# EAGLE design 3400 (EAGLE 9.6.2)
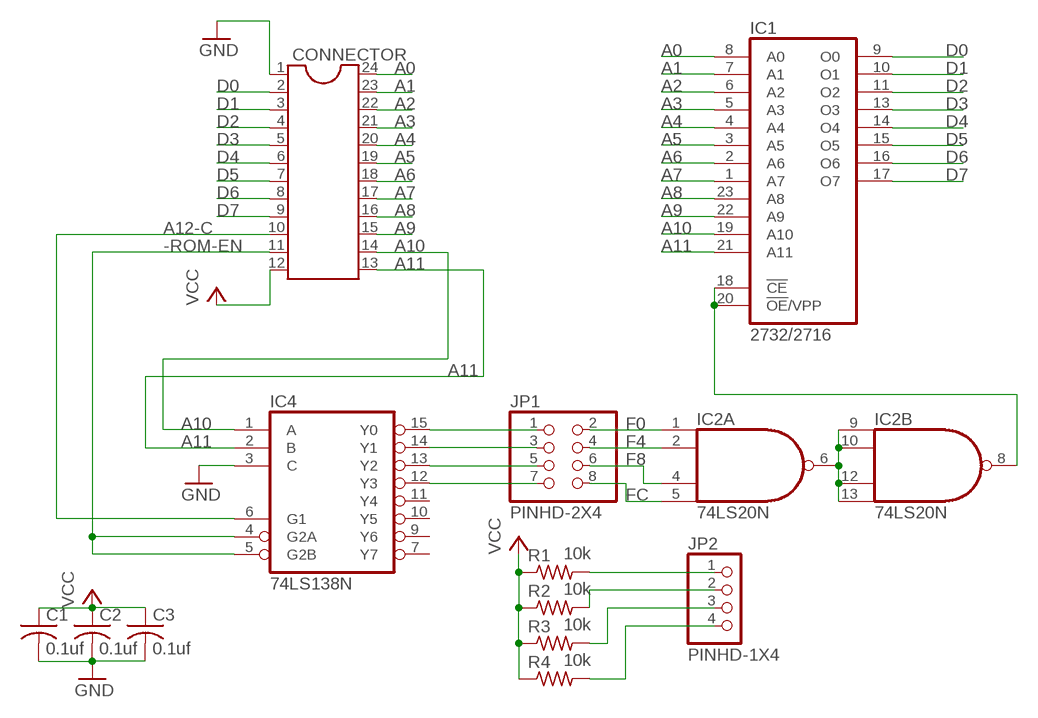
[diagram p0: schematic, sheet 1]

## Parts
C1  0.1uf  C-US025-024X044  [C025-024X044]
C2  0.1uf  C-US025-024X044  [C025-024X044]
C3  0.1uf  C-US025-024X044  [C025-024X044]
CONNECTOR  DIL24-6  [DIL24-6]
IC1  2732/2716  2732  [DIL24]
IC2  74LS20N  [DIL14]
IC4  74LS138N  [DIL16]
JP1  PINHD-2X4  [2X04]
JP2  PINHD-1X4  [1X04]
R1  10k  R-US_0207/10  [0207/10]
R2  10k  R-US_0207/10  [0207/10]
R3  10k  R-US_0207/10  [0207/10]
R4  10k  R-US_0207/10  [0207/10]

## Nets
-ROM-EN: CONNECTOR.11 IC4.4(G2A) IC4.5(G2B)
A0: CONNECTOR.24 IC1.8(A0)
A1: CONNECTOR.23 IC1.7(A1)
A2: CONNECTOR.22 IC1.6(A2)
A3: CONNECTOR.21 IC1.5(A3)
A4: CONNECTOR.20 IC1.4(A4)
A5: CONNECTOR.19 IC1.3(A5)
A6: CONNECTOR.18 IC1.2(A6)
A7: CONNECTOR.17 IC1.1(A7)
A8: CONNECTOR.16 IC1.23(A8)
A9: CONNECTOR.15 IC1.22(A9)
A10: CONNECTOR.14 IC1.19(A10) IC4.1(A)
A11: CONNECTOR.13 IC1.21(A11) IC4.2(B)
A12-C: CONNECTOR.10 IC4.6(G1)
D0: CONNECTOR.2 IC1.9(O0)
D1: CONNECTOR.3 IC1.10(O1)
D2: CONNECTOR.4 IC1.11(O2)
D3: CONNECTOR.5 IC1.13(O3)
D4: CONNECTOR.6 IC1.14(O4)
D5: CONNECTOR.7 IC1.15(O5)
D6: CONNECTOR.8 IC1.16(O6)
D7: CONNECTOR.9 IC1.17(O7)
F0: IC2.1(A:I0) JP1.2
F4: IC2.2(A:I1) JP1.4
F8: IC2.4(A:I2) JP1.6
FC: IC2.5(A:I3) JP1.8
GND: C1.2 C2.2 C3.2 CONNECTOR.1 IC4.3(C)
N$1: IC1.18(!CE) IC1.20(!OE!/VPP) IC2.8(B:O)
N$2: IC4.15(Y0) JP1.1
N$3: IC2.6(A:O) IC2.9(B:I0) IC2.10(B:I1) IC2.12(B:I2) IC2.13(B:I3)
N$4: IC4.14(Y1) JP1.3
N$5: IC4.13(Y2) JP1.5
N$6: IC4.12(Y3) JP1.7
N$11: JP2.1 R1.2
N$12: JP2.2 R2.2
N$13: JP2.3 R3.2
N$14: JP2.4 R4.2
VCC: C1.1 C2.1 C3.1 CONNECTOR.12 R1.1 R2.1 R3.1 R4.1
Unconnected: IC4.7(Y7) IC4.9(Y6) IC4.10(Y5) IC4.11(Y4)

## Power pins joined to a net without a drawn wire
GND: IC1.12(GND) IC2.7(P:GND) IC4.8(GND)
VCC: IC1.24(VCC) IC2.14(P:VCC) IC4.16(VCC)

## Library data of the parts
C1-C3 = rcl:C-US: CAPACITOR, American symbol; SPICEPREFIX: C
CONNECTOR = ic-package:DIL24: Dual In Line
IC1 = memory:2732: MEMORY
IC2 = 74xx-us:74*20: Dual 4-input NAND gate
IC4 = 74xx-us:74*138: 3-line to 8-line DECODER/DEMULTIPLEXER
JP1 = Connector:PINHD-2X4: PIN HEADER; CATEGORY: CONNECTOR; SUB-CATEGORY: PIN-HEADER
JP2 = Connector:PINHD-1X4: PIN HEADER; CATEGORY: CONNECTOR; SUB-CATEGORY: PIN-HEADER
R1-R4 = rcl:R-US_: RESISTOR, American symbol; SPICEPREFIX: R

## Board
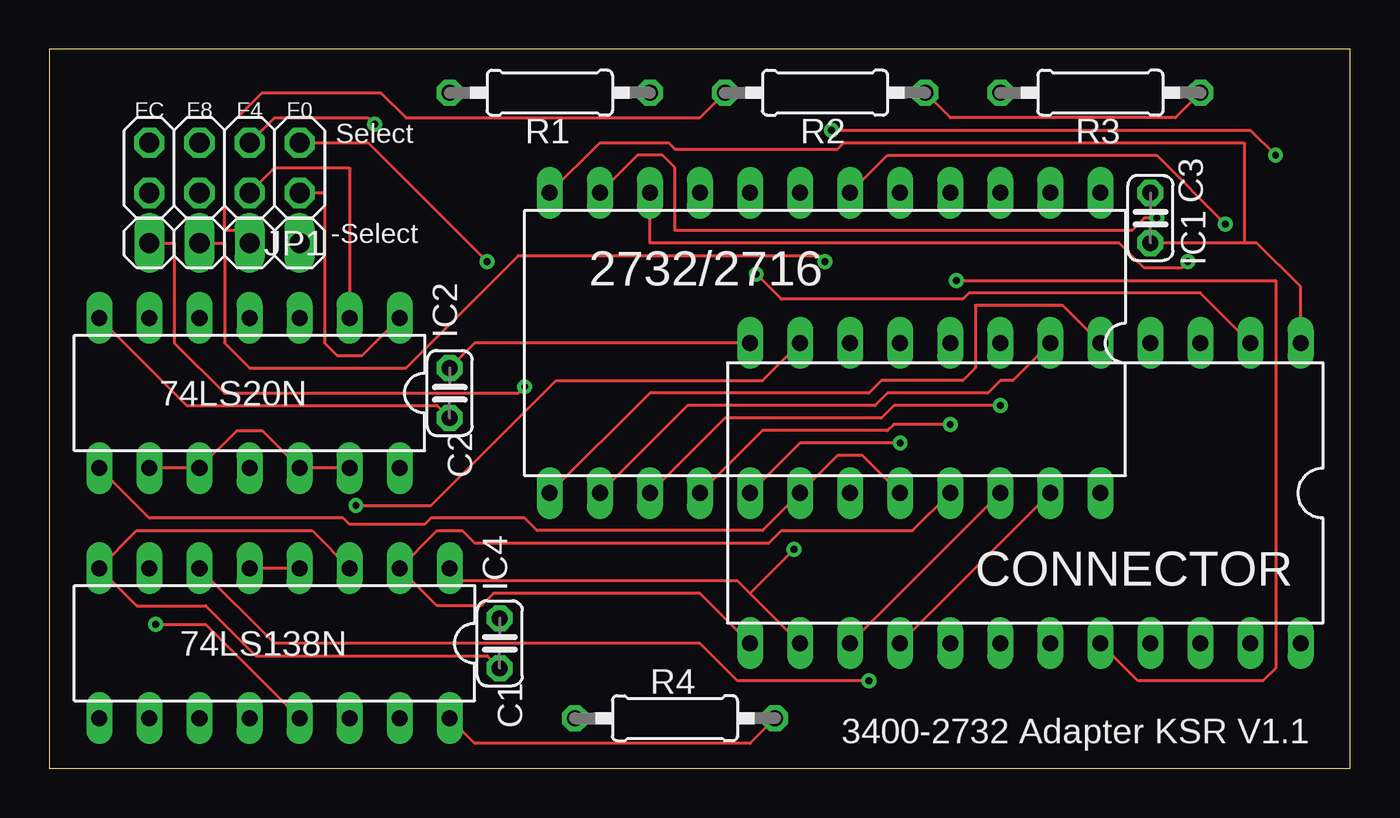
[diagram p1: board, top side]
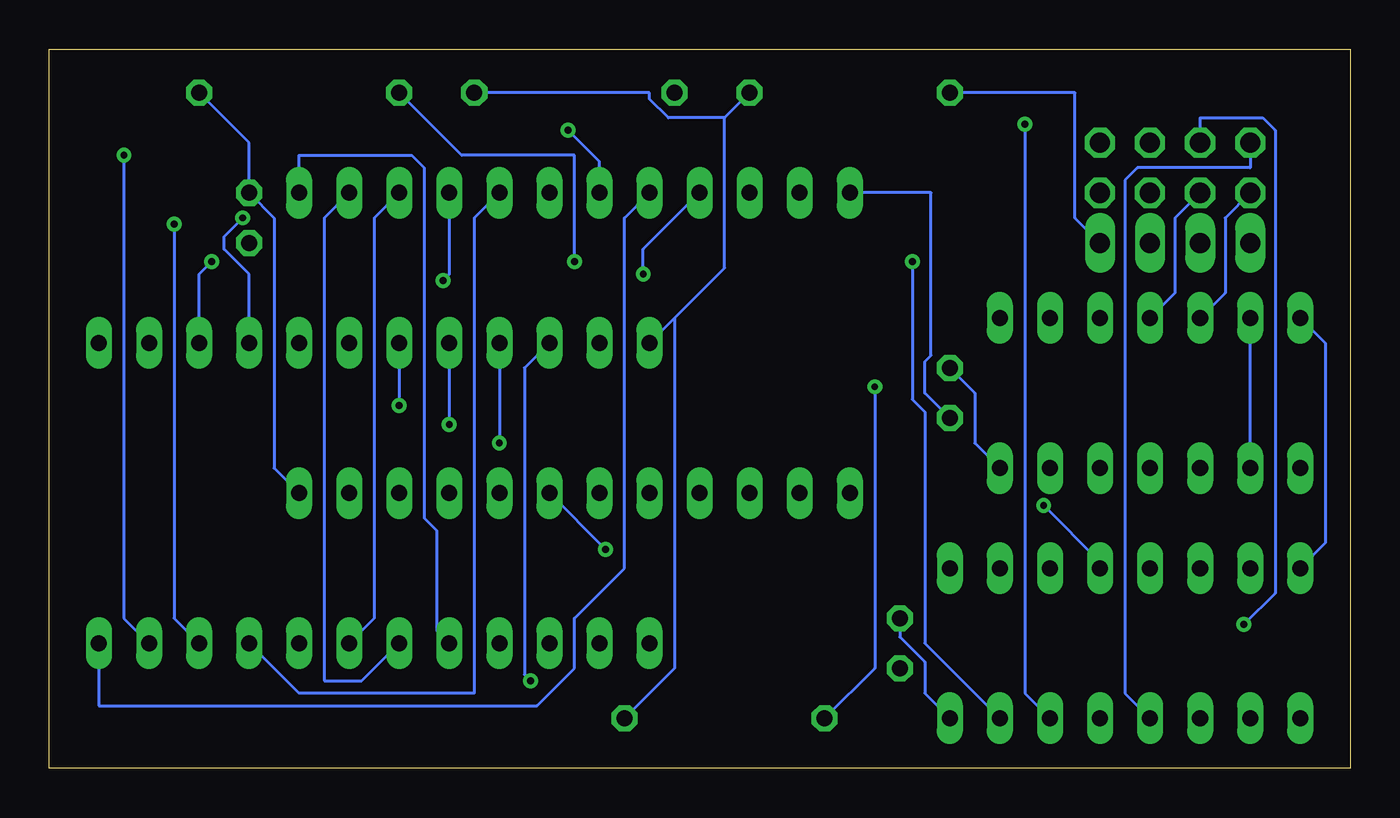
[diagram p2: board, bottom side, seen from below]

Size 66.02 x 36.5 mm. Coordinates in mm from the lower left corner, seen from the top.
Outline: 0,0 66.02,0 66.02,36.5 0,36.5 0,0
Copper layers (1*16): Top 0.035mm / dielectric 0.15mm / Bottom 0.035mm
Design rules "default *": minimum track width 6mil, minimum drill 0.35mm, track to track 15mil, track to pad 15mil, pad to pad 6mil, via to via 6mil, smd to smd 6mil, copper to edge 40mil, drill to drill 6mil, minimum pad ring 10mil, minimum via ring 8mil, stop-mask expansion 4mil, vias tented up to drill 0mil, thermal gap 10mil

### Footprints (pad centres in the part's own frame; a part is rotated, then mirrored left to right if it is on the bottom)
C025-024X044 = drill 0.813 octagon: 1 -1.27,0; 2 1.27,0
DIL24-6 = drill 0.813 long: 1 -13.97,-7.62; 2 -11.43,-7.62; 3 -8.89,-7.62; 4 -6.35,-7.62; 5 -3.81,-7.62; 6 -1.27,-7.62; 7 1.27,-7.62; 8 3.81,-7.62; 9 6.35,-7.62; 10 8.89,-7.62; 11 11.43,-7.62; 12 13.97,-7.62; 13 13.97,7.62; 14 11.43,7.62; 15 8.89,7.62; 16 6.35,7.62; 17 3.81,7.62; 18 1.27,7.62; 19 -1.27,7.62; 20 -3.81,7.62; 21 -6.35,7.62; 22 -8.89,7.62; 23 -11.43,7.62; 24 -13.97,7.62
DIL24 = drill 0.813 long: 1 -13.97,-7.62; 2 -11.43,-7.62; 3 -8.89,-7.62; 4 -6.35,-7.62; 5 -3.81,-7.62; 6 -1.27,-7.62; 7 1.27,-7.62; 8 3.81,-7.62; 9 6.35,-7.62; 10 8.89,-7.62; 11 11.43,-7.62; 12 13.97,-7.62; 13 13.97,7.62; 14 11.43,7.62; 15 8.89,7.62; 16 6.35,7.62; 17 3.81,7.62; 18 1.27,7.62; 19 -1.27,7.62; 20 -3.81,7.62; 21 -6.35,7.62; 22 -8.89,7.62; 23 -11.43,7.62; 24 -13.97,7.62
DIL14 = drill 0.813 long: 1 -7.62,-3.81; 2 -5.08,-3.81; 3 -2.54,-3.81; 4 0,-3.81; 5 2.54,-3.81; 6 5.08,-3.81; 7 7.62,-3.81; 8 7.62,3.81; 9 5.08,3.81; 10 2.54,3.81; 11 0,3.81; 12 -2.54,3.81; 13 -5.08,3.81; 14 -7.62,3.81
DIL16 = drill 0.813 long: 1 -8.89,-3.81; 2 -6.35,-3.81; 3 -3.81,-3.81; 4 -1.27,-3.81; 5 1.27,-3.81; 6 3.81,-3.81; 7 6.35,-3.81; 8 8.89,-3.81; 9 8.89,3.81; 10 6.35,3.81; 11 3.81,3.81; 12 1.27,3.81; 13 -1.27,3.81; 14 -3.81,3.81; 15 -6.35,3.81; 16 -8.89,3.81
2X04 = drill 1.016 octagon: 1 -3.81,-1.27; 2 -3.81,1.27; 3 -1.27,-1.27; 4 -1.27,1.27; 5 1.27,-1.27; 6 1.27,1.27; 7 3.81,-1.27; 8 3.81,1.27
1X04 = drill 1.016 long: 1 -3.81,0; 2 -1.27,0; 3 1.27,0; 4 3.81,0
0207/10 = drill 0.813 octagon: 1 -5.08,0; 2 5.08,0

### Placement (x,y rotation side)
C1  22.86,6.35 270 top
C2  20.32,19.05 270 top
C3  55.88,27.94 270 top
CONNECTOR  49.53,13.97 180 top
IC1  39.37,21.59 180 top
IC2  10.16,19.05 180 top
IC4  11.43,6.35 180 top
JP1  8.89,30.48 180 top
JP2  8.89,26.67 180 top
R1  25.4,34.29 180 top
R2  39.37,34.29 180 top
R3  53.34,34.29 180 top
R4  31.75,2.54 180 top

### Tracks (layer width: path | path; a pad name or v marks a point on that pad's centre or on a via)
-ROM-EN  (via drill 0.35)
  Top 0.152: IC4.4 IC4.5 | CONNECTOR.11 36.2,19.68 25.72,19.68 19.37,13.34 v15.56,13.34
  Bottom 0.152: v15.56,13.34 12.7,10.48 IC4.4
A0
  Bottom 0.152: IC1.8 36.83,27.94 36.83,10.16 39.37,7.62 39.37,5.08 41.27,3.17 63.5,3.17 CONNECTOR.24
A1  (via drill 0.35)
  Top 0.152: v62.23,31.11 60.96,32.38 v39.69,32.38
  Bottom 0.152: CONNECTOR.23 62.23,7.62 v62.23,31.11 | v39.69,32.38 38.1,30.8 IC1.7
A2  (via drill 0.35)
  Top 0.152: v59.69,27.62 56.2,31.11 42.55,31.11 IC1.6
  Bottom 0.152: CONNECTOR.22 59.69,7.62 v59.69,27.62
A3
  Bottom 0.152: CONNECTOR.21 53.34,3.81 44.45,3.81 44.45,27.94 IC1.5
A4  (via drill 0.35)
  Top 0.152: CONNECTOR.20 55.24,4.45 61.59,4.45 62.23,5.08 62.23,24.77 v46.04,24.77
  Bottom 0.152: v46.04,24.77 45.72,25.08 IC1.4
A5
  Bottom 0.152: CONNECTOR.19 49.53,7.62 49.53,27.94 IC1.3
A6
  Bottom 0.152: CONNECTOR.18 50.16,4.45 52.07,4.45 52.07,27.94 IC1.2
A7
  Bottom 0.152: CONNECTOR.17 46.35,6.99 46.35,12.06 46.99,12.7 46.99,30.48 47.62,31.11 53.34,31.11 IC1.1
A8
  Top 0.152: IC1.23 CONNECTOR.16
A9
  Top 0.152: IC1.22 CONNECTOR.15
A10  (via drill 0.35)
  Top 0.152: IC4.1 20.95,9.53 34.92,9.53 35.56,8.89 | CONNECTOR.14 35.56,8.89 | 35.56,8.89 v37.78,11.11
  Bottom 0.152: v37.78,11.11 IC1.19
A11
  Top 0.152: CONNECTOR.13 33.02,8.89 22.54,8.89 21.91,8.26 19.68,8.26 IC4.2 19.68,12.06 20.95,12.06 21.59,11.43 36.51,11.43 37.15,12.06 43.81,12.06 IC1.21
A12-C  (via drill 0.35)
  Top 0.152: IC4.6 11.43,6.35 33.02,6.35 34.92,4.45 v41.59,4.45
  Bottom 0.152: v41.59,4.45 41.91,4.76 41.91,20.32 CONNECTOR.10
D0  (via drill 0.35)
  Top 0.152: v35.88,25.08 37.15,23.81 46.35,23.81 46.67,24.13 58.42,24.13 CONNECTOR.2
  Bottom 0.152: IC1.9 35.88,26.35 v35.88,25.08
D1  (via drill 0.35)
  Top 0.152: IC1.10 30.48,26.67 54.29,26.67 55.56,25.4 57.47,25.4 v57.78,25.72
  Bottom 0.152: v57.78,25.72 58.42,25.08 CONNECTOR.3
D2  (via drill 0.35)
  Top 0.152: IC1.11 29.84,31.11 31.11,31.11 31.75,30.48 31.75,27.3 54.93,27.3 55.56,27.94 v56.2,27.94
  Bottom 0.152: v56.2,27.94 57.15,26.99 57.15,26.35 55.88,25.08 CONNECTOR.4
D3
  Top 0.152: IC1.13 30.48,19.05 41.59,19.05 42.23,19.68 46.35,19.68 46.99,20.32 46.99,23.5 51.44,23.5 CONNECTOR.5
D4
  Top 0.152: IC1.14 32.38,18.41 41.91,18.41 42.55,19.05 47.62,19.05 48.26,19.68 48.9,19.68 CONNECTOR.6
D5  (via drill 0.35)
  Top 0.152: IC1.15 34.29,17.78 42.23,17.78 42.86,18.41 v48.26,18.41
  Bottom 0.152: CONNECTOR.7 v48.26,18.41
D6  (via drill 0.35)
  Top 0.152: IC1.16 36.2,17.14 42.55,17.14 42.86,17.46 v45.72,17.46
  Bottom 0.152: CONNECTOR.8 v45.72,17.46
D7  (via drill 0.35)
  Top 0.152: IC1.17 38.1,16.51 v43.18,16.51
  Bottom 0.152: CONNECTOR.9 v43.18,16.51
F0
  Top 0.152: IC2.1 15.88,20.95 14.61,20.95 13.97,21.59 13.97,29.21 JP1.2
F4
  Top 0.152: IC2.2 15.24,30.48 11.43,30.48 JP1.4
F8
  Bottom 0.152: IC2.4 8.89,24.13 8.89,27.94 JP1.6
FC
  Bottom 0.152: IC2.5 6.35,24.13 6.35,27.94 JP1.8
GND
  Top 0.152: 60.64,26.67 61.28,26.67 63.5,24.45 CONNECTOR.1 | 60.64,26.67 C3.2 | IC4.3 13.34,12.06 4.45,12.06 IC4.8 4.45,8.26 7.94,8.26 10.48,5.71 22.23,5.71 C1.2 | C2.2 19.68,18.41 6.99,18.41 IC2.7 | 60.64,26.67 60.64,31.75 40.32,31.75 40.01,31.43 31.75,31.43 31.43,31.75 27.94,31.75 IC1.12
  Bottom 0.152: IC4.8 1.27,11.43 1.27,21.59 IC2.7 | IC1.12 21.27,29.21 21.27,20.95 21.59,20.64 21.59,19.05 C2.2
N$1
  Top 0.152: IC1.20 41.27,15.88 40.01,15.88 IC1.18 36.2,12.06 24.77,12.06 24.13,12.7 19.37,12.7 19.05,12.38 15.24,12.38 14.92,12.7 5.08,12.7 IC2.8
N$2  (via drill 0.35)
  Top 0.152: v22.23,25.72 16.19,31.75 JP1.1
  Bottom 0.152: IC4.15 21.59,6.35 21.59,18.1 22.23,18.73 v22.23,25.72
N$3
  Top 0.152: IC2.13 IC2.12 10.79,17.14 9.53,17.14 IC2.10 IC2.9
  Bottom 0.152: IC2.9 IC2.6
N$4  (via drill 0.35)
  Top 0.152: v16.51,32.7 16.19,33.02 11.43,33.02 JP1.3
  Bottom 0.152: IC4.14 16.51,3.81 v16.51,32.7
N$5  (via drill 0.35)
  Top 0.152: IC4.13 7.94,7.3 v5.4,7.3
  Bottom 0.152: v5.4,7.3 3.81,8.89 3.81,32.38 4.45,33.02 7.62,33.02 JP1.5
N$6
  Bottom 0.152: IC4.12 11.43,3.81 11.43,29.84 10.79,30.48 5.08,30.48 JP1.7
N$11
  Bottom 0.152: R1.2 13.97,34.29 13.97,27.94 JP2.1
N$12
  Top 0.152: R2.2 33.02,33.02 18.1,33.02 16.83,34.29 10.79,34.29 8.89,32.38 8.89,27.3 9.53,27.3 JP2.2
N$13  (via drill 0.35)
  Top 0.152: v39.37,25.72 39.05,26.04 23.81,26.04 18.1,20.32 10.16,20.32 8.89,21.59 8.89,26.67 JP2.3
  Bottom 0.152: R3.2 45.09,31.11 39.37,31.11 v39.37,25.72
N$14  (via drill 0.35)
  Top 0.152: v24.13,19.37 23.81,19.05 8.89,19.05 6.35,21.59 6.35,26.67 JP2.4
  Bottom 0.152: R4.2 24.13,5.08 v24.13,19.37
VCC
  Top 0.152: R2.1 45.72,33.02 57.15,33.02 R3.1 | C2.1 21.59,21.59 CONNECTOR.12 | IC4.16 21.59,1.27 35.56,1.27 R4.1
  Bottom 0.152: IC1.24 54.61,15.24 54.61,27.94 C3.1 55.88,31.75 R3.1 | IC4.16 21.59,3.81 21.59,5.4 22.86,6.67 C1.1 | IC2.14 19.05,16.51 19.05,19.05 C2.1 | 31.75,33.02 R1.1 | 31.75,33.02 31.75,25.4 34.29,22.86 | CONNECTOR.12 34.29,22.86 | R4.1 34.29,5.08 34.29,22.86 | R2.1 35.56,34.29 35.56,33.97 34.61,33.02 31.75,33.02

### Text on the board
tNames: FC | F8 | F4 | F0 | Select | -Select | 3400-2732 Adapter KSR V1.1